# Altium project MSXII_ChargerInterface.PrjPcb (part 1 of 2)
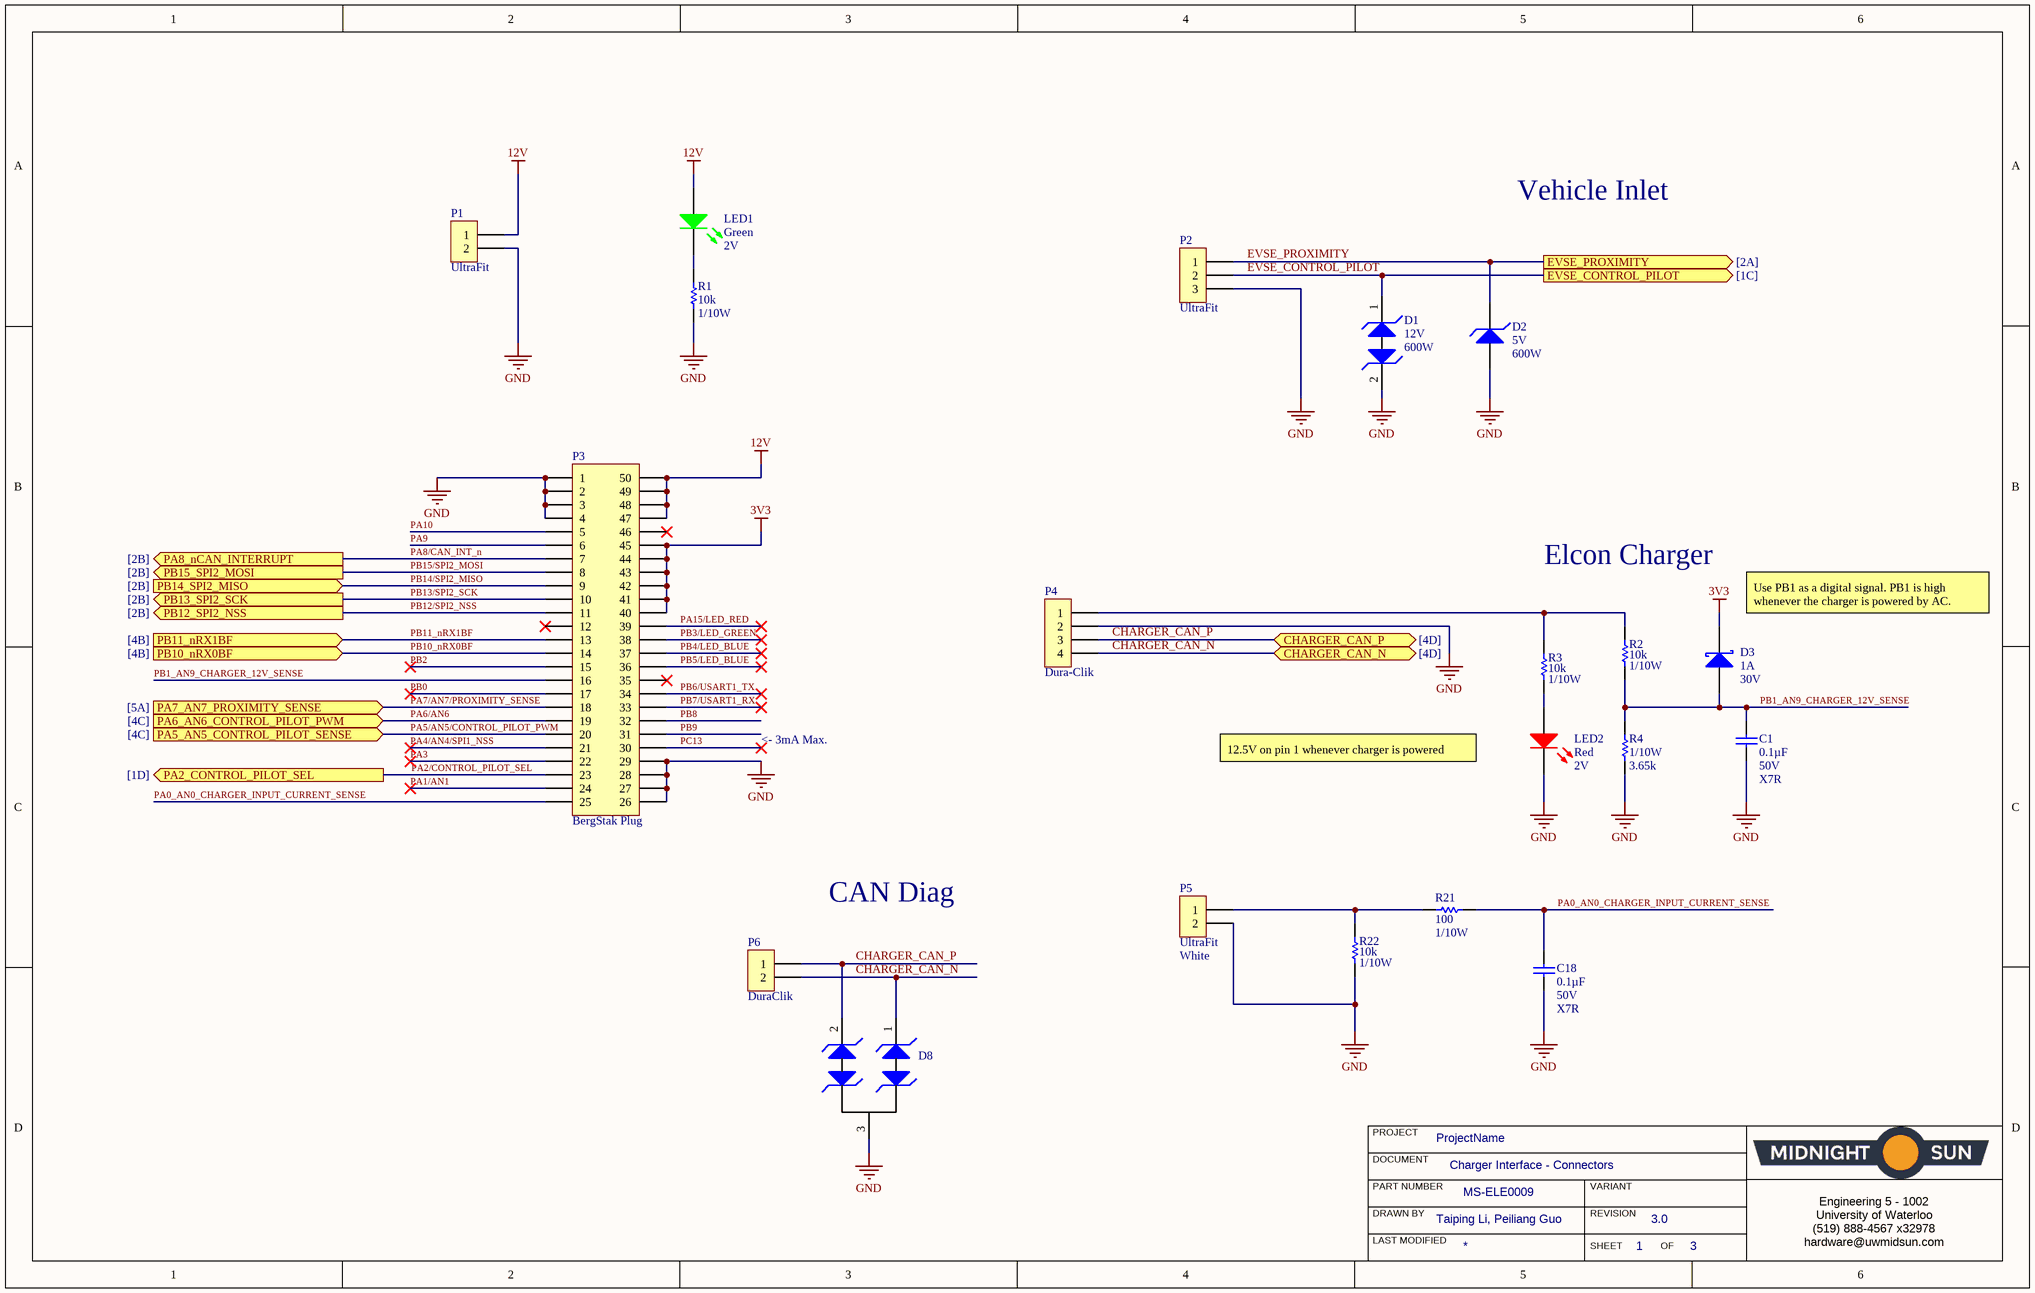
[diagram p0: Charger Interface - Connectors.SchDoc]
SheetTotal: 4; ProjectRevision: 3.0; ProjectAuthor: Taiping Li, Peiliang Guo; Project: Charger Interface Board; MSPartNumber: MS-ELE0009
3 sheets, 67 parts. Net scope: flat (ports and power ports of the same name join across sheets).
Board file: Charger Interface.PcbDoc
Sheets:
  Charger Interface - Connectors.SchDoc
  Charger Interface - CAN.SchDoc
  Charger Interface - J1772 Interface.SchDoc

## Sheet Charger Interface - Connectors.SchDoc: Charger Interface - Connectors
size B; Organization: Midnight Sun Solar Rayce Car Team; Address1: University of Waterloo; Address2: 200 University Ave W; Address3: Waterloo, ON, Canada; Address4: N2L 3E9; DocumentNumber: 1; SheetNumber: 1; SheetTotal: 3; Website: www.uwmidsun.com; ProjectName: ProjectName

### Parts
C1  Capacitance: 0.1µF  Voltage: 50V  Temperature Coefficient: X7R  [CAP, 0603]  (hidden comment: CAP CER 0.1UF 50V 10% X7R 0603)
C18  Capacitance: 0.1µF  Voltage: 50V  Temperature Coefficient: X7R  [CAP, 0603]  (hidden comment: CAP CER 0.1UF 50V 10% X7R 0603)
D1  Voltage - Reverse Standoff (Typ): 12V  Power - Peak Pulse: 600W  [DO-214AA Diode]  (hidden comment: DIODE TVS 12VWM 19.6VC DO-214AA (SMB))
D2  Voltage - Reverse Standoff (Typ): 5V  Power - Peak Pulse: 600W  [DO-214AA Diode]  (hidden comment: DIODE TVS 5VWM 9.1VC DO-214AA (SMB))
D3  Current - Average Rectified (Io): 1A  Voltage - DC Reverse (Vr) (Max): 30V  [DIODE SCHOTTKY 30V 1A POWERDI123]  (hidden comment: DIODE SCHOTTKY 30V 1A POWERDI123)
D8  DIODE TVS 24VWM 70VC SOT23  [MOSFET P-CH 30V 3.8A SOT-23]  (value not drawn)
LED1  Color: Green  Voltage - Forward (Vf) (Typ): 2V  [LED_0603]  (hidden comment: LED GREEN CLEAR 2V 0603)
LED2  Color: Red  Voltage - Forward (Vf) (Typ): 2V  [LED_0603]  (hidden comment: LED RED CLEAR 2V 0603)
P1  Series: UltraFit  [CONN, 2POS ULTRA-FIT]  (hidden comment: CONN 2POS ULTRA-FIT 0.138")
P2  Series: UltraFit  [CONN, 3POS ULTRA-FIT]  (hidden comment: CONN 3POS ULTRA-FIT 0.138")
P3  Series: BergStak Plug  [CONN, Bergstak 50 Pos Plug]  (hidden comment: CONN 50POS Bergstak Plug 0.02")
P4  Dura-Clik  [CONN, 4POS DURA-CLIK VERT]
P5  Series: UltraFit  Color: White  [CONN, 2POS ULTRA-FIT - NATURAL COLOR]  (hidden comment: CONN 2POS ULTRA-FIT NATURAL COLOR 0.138")
P6  Series: DuraClik  [CONN, 2POS Dura-Click]  (hidden comment: CONN 2POS DURA-CLIK 0.079")
R1  Resistance: 10k  Power: 1/10W  [RES, 0603]  (hidden comment: RES 10K OHM 1% 1/10W 0603)
R2  Resistance: 10k  Power: 1/10W  [RES, 0603]  (hidden comment: RES 10K OHM 1% 1/10W 0603)
R3  Resistance: 10k  Power: 1/10W  [RES, 0603]  (hidden comment: RES 10K OHM 1% 1/10W 0603)
R4  Power Rating: 1/10W  Resistance: 3.65k  [RES, 0603]  (hidden comment: RES 3.65K OHM 0.1% 1/10W 0603)
R21  Resistance: 100  Power: 1/10W  [RES, 0603]  (hidden comment: RES 100 OHM 1% 1/10W 0603)
R22  Resistance: 10k  Power: 1/10W  [RES, 0603]  (hidden comment: RES 10K OHM 1% 1/10W 0603)

### Ports
CHARGER_CAN_N (bidir, see [4D]), CHARGER_CAN_P (bidir, see [4D]), EVSE_CONTROL_PILOT (out, see [1C]), EVSE_PROXIMITY (out, see [2A]), PA2_CONTROL_PILOT_SEL (out, see [1D]), PA5_AN5_CONTROL_PILOT_SENSE (in, see [4C]), PA6_AN6_CONTROL_PILOT_PWM (in, see [4C]), PA7_AN7_PROXIMITY_SENSE (in, see [5A]), PA8_nCAN_INTERRUPT (out, see [2B]), PB10_nRX0BF (in, see [4B]), PB11_nRX1BF (in, see [4B]), PB12_SPI2_NSS (out, see [2B]), PB13_SPI2_SCK (out, see [2B]), PB14_SPI2_MISO (in, see [2B]), PB15_SPI2_MOSI (out, see [2B])

### Nets
3V3: D3.2(K) P3.40 P3.41 P3.42 P3.43 P3.44 P3.45
12V: LED1.1(A) P1.1 P3.47 P3.48 P3.49 P3.50
GND: C1.2 C18.2 D1.2(Cathode2) D2.1 D8.3(Common_Cathode) LED2.2(K) P1.2 P2.3 P3.1 P3.2 P3.3 P3.4 P3.26 P3.27 P3.28 P3.29 P4.2 P5.2 R1.2 R4.2 R22.2
CHARGER_CAN_N: D8.1(Cathode1) P4.4 P6.2 ; port CHARGER_CAN_N
CHARGER_CAN_P: D8.2(Cathode2) P4.3 P6.1 ; port CHARGER_CAN_P
EVSE_CONTROL_PILOT: D1.1(Cathode1) P2.2 ; port EVSE_CONTROL_PILOT
EVSE_PROXIMITY: D2.2 P2.1 ; port EVSE_PROXIMITY
PA0_AN0_CHARGER_INPUT_CURRENT_SENSE: C18.1 P3.25 R21.2
PA1/AN1: P3.24
PA2/CONTROL_PILOT_SEL: P3.23 ; port PA2_CONTROL_PILOT_SEL
PA3: P3.22
PA4/AN4/SPI1_NSS: P3.21
PA5/AN5/CONTROL_PILOT_PWM: P3.20 ; port PA5_AN5_CONTROL_PILOT_SENSE
PA6/AN6: P3.19 ; port PA6_AN6_CONTROL_PILOT_PWM
PA7/AN7/PROXIMITY_SENSE: P3.18 ; port PA7_AN7_PROXIMITY_SENSE
PA8/CAN_INT_n: P3.7 ; port PA8_nCAN_INTERRUPT
PA9: P3.6
PA10: P3.5
PA15/LED_RED: P3.39
PB0: P3.17
PB1_AN9_CHARGER_12V_SENSE: C1.1 D3.1(A) P3.16 R2.2 R4.1
PB2: P3.15
PB3/LED_GREEN: P3.38
PB4/LED_BLUE: P3.37
PB5/LED_BLUE: P3.36
PB6/USART1_TX: P3.34
PB7/USART1_RX: P3.33
PB8: P3.32
PB9: P3.31
PB10_nRX0BF: P3.14 ; port PB10_nRX0BF
PB11_nRX1BF: P3.13 ; port PB11_nRX1BF
PB12/SPI2_NSS: P3.11 ; port PB12_SPI2_NSS
PB13/SPI2_SCK: P3.10 ; port PB13_SPI2_SCK
PB14/SPI2_MISO: P3.9 ; port PB14_SPI2_MISO
PB15/SPI2_MOSI: P3.8 ; port PB15_SPI2_MOSI
PC13: P3.30
NetLED1_2: LED1.2(K) R1.1
NetLED2_1: LED2.1(A) R3.2
NetP4_1: P4.1 R2.1 R3.1
NetP5_1: P5.1 R21.1 R22.1

Not connected (* = marked no-connect by the designer): P3 12* 35* 46*

### Notes on the sheet
- Vehicle Inlet
- Elcon Charger
- (near D3) Use PB1 as a digital signal. PB1 is high whenever the charger is powered by AC.
- <- 3mA Max.
- 12.5V on pin 1 whenever charger is powered
- CAN Diag
- PROJECT
- DOCUMENT
- DRAWN BY
- LAST MODIFIED
- PART NUMBER
- REVISION
- SHEET
- VARIANT
- OF
- Engineering 5 - 1002
  University of Waterloo
  (519) 888-4567 x32978
  hardware@uwmidsun.com

### Library data of the parts
C1 C18 = CAP CER 0.1UF 50V 10% X7R 0603: 0.10µF ±10% 50V Ceramic Capacitor X7R 0603 (1608 Metric); Manufacturer 1: AVX Corporation; Manufacturer Part Number 1: 06035C104KAT2A; Supplier 1: Digi-Key; Supplier Part Number 1: 478-5052-1-ND; Packaging: Cut Tape (CT); Part Status: Active; Operating Temperature: -55°C ~ 125°C; Ratings: -; Mounting Type: Surface Mount, MLCC; Package / Case: 0603 (1608 Metric); Size / Dimension: 0.063" L x 0.032" W (1.60mm x 0.81mm); Height - Seated (Max): -; Thickness (Max): 0.035" (0.90mm); Lead Spacing: -; Lead Style: -; ComponentLink1URL: http://datasheets.avx.com/X7RDielectric.pdf; ComponentLink1Description: http://datasheets.avx.com/X7RDielectric.pdf; Tolerance: ±10%
D1 = DIODE TVS 12VWM 19.6VC DO-214AA (SMB): TVS DIODE 12V 19.6V DO214AA; Manufacturer: Vishay Semiconductor Diodes Division; Manufacturer Part Number: SMBJ12CD-M3/H; Type: Zener; Voltage - Breakdown (Min): 13.5V; Current - Peak Pulse (10/1000µs): 30.6A; Power Line Protection: No; Supplier 1: Digi-Key; RoHS: RoHS Compliant; Category: Circuit Protection; Stock 1: 4469; Pricing 1: 1=0.69, 10=0.565, 25=0.516, 100=0.3841, 250=0.34808 (CAD); Packaging: Cut Tape (CT); Part Status: Active; Voltage - Clamping (Max) @ Ipp: 19.6V; Applications: General Purpose; Capacitance @ Frequency: -; Operating Temperature: -55°C ~ 150°C (TJ); Mounting Type: Surface Mount; Package / Case: DO-214AA, SMB; Supplier Device Package: DO-214AA (SMBJ); ComponentLink1URL: http://www.vishay.com/docs/87606/87606.pdf; ComponentLink1Description: http://www.vishay.com/docs/87606/87606.pdf; Supplier Part Number 1: SMBJ12CD-M3/HGICT-ND
D2 = DIODE TVS 5VWM 9.1VC DO-214AA (SMB): TVS DIODE 5V 9.1V DO214AA; Manufacturer: Vishay Semiconductor Diodes Division; Manufacturer Part Number: SMBJ5.0D-M3/H; Type: Zener; Voltage - Breakdown (Min): 6.5V; Current - Peak Pulse (10/1000µs): 65.9A; Power Line Protection: No; Supplier 1: Digi-Key; RoHS: RoHS Compliant; Category: Circuit Protection; Stock 1: 6900; Pricing 1: 1=0.51, 10=0.416, 25=0.3808, 100=0.2833, 250=0.25668 (CAD); Packaging: Cut Tape (CT); Part Status: Active; Voltage - Clamping (Max) @ Ipp: 9.1V; Applications: General Purpose; Capacitance @ Frequency: -; Operating Temperature: -55°C ~ 150°C (TJ); Mounting Type: Surface Mount; Package / Case: DO-214AA, SMB; Supplier Device Package: DO-214AA (SMBJ); ComponentLink1URL: http://www.vishay.com/docs/87606/87606.pdf; ComponentLink1Description: http://www.vishay.com/docs/87606/87606.pdf; Supplier Part Number 1: SMBJ5.0D-M3/HGICT-ND
D3 = DIODE SCHOTTKY 30V 1A POWERDI123: Diode Schottky 30V 1A Surface Mount PowerDI™ 123; Manufacturer: Diodes Incorporated; Manufacturer Part Number: DFLS130L-7; Speed: Fast Recovery =< 500ns, > 200mA (Io); Current - Reverse Leakage @ Vr: 1mA @ 30V; Capacitance @ Vr, F: 76pF @ 10V, 1MHz; Voltage - Forward (Vf) (Max) @ If: 310mV @ 1A; Supplier 1: Digi-Key; RoHS: RoHS Compliant; Category: Discrete Semiconductor Products; Stock 1: 68200; Packaging: Cut Tape (CT); Part Status: Active; Diode Type: Schottky; Mounting Type: Surface Mount; Package / Case: POWERDI®123; Supplier Device Package: PowerDI™ 123; Operating Temperature - Junction: -40°C ~ 125°C; ComponentLink1URL: https://www.diodes.com/assets/Datasheets/ds30492.pdf; ComponentLink1Description: https://www.diodes.com/assets/Datasheets/ds30492.pdf; Supplier Part Number 1: DFLS130LDICT-ND; Pricing 1: 1=0.7, 10=0.599, 100=0.447, 500=0.35126, 1000=0.27142 (CAD)
D8 = DIODE TVS 24VWM 70VC SOT23: TVS DIODE 24VWM 70VC SOT23; Manufacturer 1: Nexperia USA Inc.; Manufacturer Part Number 1: PESD1CAN,215; Type: Zener; Voltage - Breakdown (Min): 25.4V; Voltage - Clamping (Max) @ Ipp: 70V; Current - Peak Pulse (10/1000µs): 3A (8/20µs); Power - Peak Pulse: 200W; Power Line Protection: No; Capacitance @ Frequency: 11pF @ 1MHz; Supplier 1: Digi-Key; Supplier Part Number 1: 1727-3817-1-ND; Packaging: Cut Tape (CT); Part Status: Active; Operating Temperature: -65°C ~ 150°C (TA); Mounting Type: Surface Mount; Package / Case: TO-236-3, SC-59, SOT-23-3; Supplier Device Package: SOT-23 (TO-236AB); ComponentLink1URL: http://assets.nexperia.com/documents/data-sheet/PESD1CAN.pdf; ComponentLink1Description: http://assets.nexperia.com/documents/data-sheet/PESD1CAN.pdf
LED1 = LED GREEN CLEAR 2V 0603: Green 572nm LED Indication - Discrete 2V 0603 (1608 Metric); Manufacturer: Wurth Electronics Inc.; Manufacturer Part Number: 150060VS75000; Lens Color: Colorless; Millicandela Rating: 40mcd; Lens Style/Size: Rectangle with Flat Top, 1.10mm x 0.70mm; Current - Test: 20mA; Viewing Angle: 140°; Wavelength - Dominant: 570nm; Supplier 1: Digi-Key; RoHS: RoHS Compliant; Category: Optoelectronics; Stock 1: 9408; Pricing 1: 1=0.21, 100=0.1617, 500=0.13964 (CAD); Packaging: Cut Tape (CT); Part Status: Active; Lens Transparency: Clear; Mounting Type: Surface Mount; Wavelength - Peak: 572nm; Features: -; Package / Case: 0603 (1608 Metric); Supplier Device Package: 0603; Size / Dimension: 1.60mm L x 0.80mm W; Height (Max): 0.80mm; ComponentLink1URL: http://katalog.we-online.de/led/datasheet/150060VS75000.pdf; ComponentLink1Description: http://katalog.we-online.de/led/datasheet/150060VS75000.pdf; Supplier Part Number 1: 732-4980-1-ND
LED2 = LED RED CLEAR 2V 0603: Red 631nm LED Indication - Discrete 2V 0603 (1608 Metric); Manufacturer: Wurth Electronics Inc.; Manufacturer Part Number: 150060RS75000; Lens Color: Colorless; Millicandela Rating: 250mcd; Lens Style/Size: Rectangle with Flat Top, 1.10mm x 0.70mm; Current - Test: 20mA; Viewing Angle: 140°; Wavelength - Dominant: 625nm; Wavelength - Peak: 630nm; Supplier 1: Digi-Key; RoHS: RoHS Compliant; Category: Optoelectronics; Stock 1: 35521; Pricing 1: 1=0.21, 100=0.1617, 500=0.13964 (CAD); Packaging: Cut Tape (CT); Part Status: Active; Lens Transparency: Clear; Mounting Type: Surface Mount; Features: -; Package / Case: 0603 (1608 Metric); Supplier Device Package: 0603; Size / Dimension: 1.60mm L x 0.80mm W; Height (Max): 0.80mm; ComponentLink1URL: http://katalog.we-online.de/led/datasheet/150060RS75000.pdf; ComponentLink1Description: http://katalog.we-online.de/led/datasheet/150060RS75000.pdf; Supplier Part Number 1: 732-4978-1-ND
P1 = CONN 2POS ULTRA-FIT 0.138": 2 Positions Header, Shrouded Connector 0.138" (3.50mm) Through Hole Gold; Manufacturer 1: Molex, LLC; Manufacturer Part Number 1: 1722861302; Style: Board to Board or Cable; Shrouding: Shrouded - 4 Wall; Number of Positions: 2; Number of Positions Loaded: All; Contact Length - Post: 0.126" (3.20mm); Material Flammability Rating: UL94 V-0; Mated Stacking Heights: 26.99mm; Voltage: 400V; Supplier 1: Digi-Key; Supplier Part Number 1: WM11673-ND; Packaging: Tray; Part Status: Active; Connector Type: Header; Contact Type: Male Pin; Pitch - Mating: 0.138" (3.50mm); Number of Rows: 1; Row Spacing - Mating: -; Mounting Type: Through Hole; Termination: Kinked Pin, Solder; Fastening Type: Latch Holder; Contact Length - Mating: -; Overall Contact Length: -; Insulation Height: 0.465" (11.80mm); Contact Shape: Square; Contact Finish - Mating: Gold; Contact Finish Thickness - Mating: 30µin (0.76µm); Contact Finish - Post: Tin; Contact Material: Copper Alloy; Insulation Material: Liquid Crystal Polymer (LCP); Operating Temperature: -40°C ~ 120°C; Ingress Protection: -; Insulation Color: Black; Current Rating: -; Contact Finish Thickness - Post: 60µin (1.52µm); ComponentLink1URL: http://www.molex.com/pdm_docs/sd/1722861302_sd.pdf; ComponentLink1Description: http://www.molex.com/pdm_docs/sd/1722861302_sd.pdf
P2 = CONN 3POS ULTRA-FIT 0.138": 3 Positions Header Connector 0.138" (3.50mm) Through Hole Tin; Manufacturer 1: Molex, LLC; Manufacturer Part Number 1: 1722871103; Style: Board to Cable/Wire; Shrouding: Shrouded - 4 Wall; Number of Positions: 3; Number of Positions Loaded: All; Contact Length - Post: 0.126" (3.20mm); Material Flammability Rating: UL94 V-0; Mated Stacking Heights: 26.99mm; Voltage: 400V; Supplier 1: Digi-Key; Supplier Part Number 1: WM11702-ND; Packaging: Tray; Part Status: Active; Connector Type: Header; Contact Type: Male Pin; Pitch - Mating: 0.138" (3.50mm); Number of Rows: 1; Row Spacing - Mating: -; Mounting Type: Through Hole; Termination: Solder; Fastening Type: Latch Holder; Contact Length - Mating: -; Overall Contact Length: -; Insulation Height: 0.465" (11.80mm); Contact Shape: Square; Contact Finish - Mating: Tin; Contact Finish Thickness - Mating: 60µin (1.52µm); Contact Finish - Post: Tin; Contact Material: Copper Alloy; Insulation Material: Liquid Crystal Polymer (LCP); Operating Temperature: -40°C ~ 105°C; Ingress Protection: -; Insulation Color: Black; Current Rating: -; Contact Finish Thickness - Post: 60µin (1.52µm); ComponentLink1URL: http://www.molex.com/pdm_docs/sd/1722871103_sd.pdf; ComponentLink1Description: http://www.molex.com/pdm_docs/sd/1722871103_sd.pdf
P3 = CONN 50POS Bergstak Plug 0.02": 50 Position Connector Plug, Outer Shroud Contacts Surface Mount Gold; Manufacturer 1: Amphenol FCI; Manufacturer Part Number 1: 10132797-055100LF; Number of Positions: 50; Mated Stacking Heights: 5mm; Pitch: 0.020" (0.50mm); Supplier 1: Digi-Key; Supplier Part Number 1: 609-5226-1-ND; Packaging: Cut Tape (CT); Part Status: Active; Connector Type: Plug, Outer Shroud Contacts; Number of Rows: 2; Mounting Type: Surface Mount; Contact Finish: Gold; Contact Finish Thickness: 1µin (0.025µm); Height Above Board: 0.169" (4.30mm); ComponentLink1URL: http://portal.fciconnect.com/Comergent//fci/drawing/10132797.pdf; ComponentLink1Description: http://portal.fciconnect.com/Comergent//fci/drawing/10132797.pdf
P4 = CONN 4POS DURA-CLIK 0.079": 4 Positions Header Connector 0.079" (2.00mm) Surface Mount Tin; Manufacturer: Molex, LLC; Manufacturer Part Number: 5600200420; Style: Board to Cable/Wire; Shrouding: Shrouded - 4 Wall; Number of Positions: 4; Number of Positions Loaded: All; Mated Stacking Heights: 9.3mm; Supplier 1: Digi-Key; RoHS: RoHS Compliant; Category: Connectors, Interconnects; Stock 1: 9367; Pricing 1: 1=2.23, 10=2.022, 25=1.898, 50=1.8156, 100=1.733 (CAD); Packaging: Cut Tape (CT); Part Status: Active; Connector Type: Header; Contact Type: Male Pin; Pitch - Mating: 0.079" (2.00mm); Number of Rows: 1; Row Spacing - Mating: -; Mounting Type: Surface Mount; Termination: Solder; Fastening Type: Latch Lock; Contact Length - Mating: -; Contact Length - Post: -; Overall Contact Length: -; Insulation Height: 0.315" (8.00mm); Contact Shape: Square; Contact Finish - Mating: Tin; Contact Finish Thickness - Mating: -; Contact Finish - Post: Tin; Contact Material: Copper Alloy; Insulation Material: Polyamide (PA), Nylon; Features: Solder Retention; Operating Temperature: -; Ingress Protection: -; Material Flammability Rating: -; Insulation Color: Natural; Current Rating: -; Voltage Rating: -; Contact Finish Thickness - Post: -; Applications: Automotive, Industrial; ComponentLink1URL: http://www.molex.com/pdm_docs/sd/5600200420_sd.pdf; ComponentLink1Description: http://www.molex.com/pdm_docs/sd/5600200420_sd.pdf; Supplier Part Number 1: WM10864CT-ND
P5 = CONN 2POS ULTRA-FIT NATURAL COLOR 0.138": 2 Positions Header, Shrouded Connector 0.138" (3.50mm) Through Hole; Manufacturer 1: Molex, LLC; Manufacturer Part Number 1: 1722872102; Style: Board to Cable/Wire; Shrouding: Shrouded - 4 Wall; Number of Positions: 2; Number of Positions Loaded: All; Contact Length - Post: 0.126" (3.20mm); Material Flammability Rating: UL94 V-0; Mated Stacking Heights: 26.99mm; Voltage: 400V; Supplier 1: Digi-Key; Supplier Part Number 1: WM11722-ND; Packaging: Tray; Part Status: Active; Connector Type: Header; Contact Type: Male Pin; Pitch - Mating: 0.138" (3.50mm); Number of Rows: 1; Row Spacing - Mating: -; Mounting Type: Through Hole; Termination: Solder; Fastening Type: Latch Holder; Contact Length - Mating: -; Overall Contact Length: -; Insulation Height: 0.465" (11.80mm); Contact Shape: Square; Contact Finish - Mating: Tin; Contact Finish Thickness - Mating: 60µin (1.52µm); Contact Finish - Post: Tin; Contact Material: Copper Alloy; Insulation Material: Liquid Crystal Polymer (LCP); Operating Temperature: -40°C ~ 105°C; Ingress Protection: -; Insulation Color: Natural; Current Rating: -; Contact Finish Thickness - Post: 60µin (1.52µm); ComponentLink1URL: http://www.molex.com/pdm_docs/sd/1722872102_sd.pdf; ComponentLink1Description: http://www.molex.com/pdm_docs/sd/1722872102_sd.pdf
P6 = CONN 2POS DURA-CLIK 0.079": 2 Positions Header, Shrouded Connector 0.079" (2.00mm) Surface Mount, Right Angle Tin; Manufacturer 1: Molex, LLC; Manufacturer Part Number 1: 5023520200; Style: Board to Cable/Wire; Shrouding: Shrouded - 4 Wall; Number of Positions: 2; Number of Positions Loaded: All; Contact Length - Mating: 0.135" (3.45mm); Material Flammability Rating: UL94 V-0; Mated Stacking Heights: 11mm; Supplier 1: Digi-Key; Supplier Part Number 1: WM7169CT-ND; Packaging: Cut Tape (CT); Part Status: Active; Connector Type: Header; Contact Type: Male Pin; Number of Rows: 1; Row Spacing - Mating: -; Mounting Type: Surface Mount, Right Angle; Termination: Solder; Fastening Type: Latch Lock; Contact Length - Post: -; Overall Contact Length: -; Insulation Height: 0.252" (6.40mm); Contact Shape: Square; Contact Finish - Mating: Tin; Contact Finish Thickness - Mating: -; Contact Finish - Post: Tin; Contact Material: Copper Alloy; Insulation Material: Polyamide (PA), Nylon; Operating Temperature: -; Ingress Protection: -; Insulation Color: Natural; Current Rating: -; Contact Finish Thickness - Post: -; ComponentLink1URL: http://www.molex.com/pdm_docs/sd/5023520200_sd.pdf; ComponentLink1Description: http://www.molex.com/pdm_docs/sd/5023520200_sd.pdf; Voltage: -; Pitch - Mating: 0.079" (2.00mm)
R1-R3 R22 = RES 10K OHM 1% 1/10W 0603: RES SMD 10K OHM 1% 1/10W 0603; Manufacturer 1: Yageo; Manufacturer Part Number 1: RC0603FR-0710KL; Temperature Coefficient: ±100ppm/°C; Supplier 1: Digi-Key; Supplier Part Number 1: 311-10.0KHRCT-ND; Packaging: Cut Tape (CT); Part Status: Active; Composition: Thick Film; Operating Temperature: -55°C ~ 155°C; Package / Case: 0603 (1608 Metric); Supplier Device Package: 0603; Size / Dimension: 0.063" L x 0.031" W (1.60mm x 0.80mm); Height - Seated (Max): 0.022" (0.55mm); Failure Rate: -; ComponentLink1URL: http://www.yageo.com/documents/recent/PYu-RC_Group_51_RoHS_L_7.pdf; ComponentLink1Description: http://www.yageo.com/documents/recent/PYu-RC_Group_51_RoHS_L_7.pdf; Tolerance: ±1%
R4 = RES 3.65K OHM 0.1% 1/10W 0603: 3.65 kOhms ±0.1% 0.1W, 1/10W Chip Resistor 0603 (1608 Metric) Automotive AEC-Q200 Thin Film; Manufacturer: Panasonic; Manufacturer Part Number: ERA3AEB3651V; Voltage Rating: 150V; Temperature Coefficient: 25ppm/°C; Max Power Dissipation: 100mW; Voltage Rating (DC): 75V; Supplier 1: Digi-Key; Stock 1: 140813; Pricing 1: 1=0.35, 10=0.3, 100=0.1172, 1000=0.0491, 2500=0.045 (USD); Mount: Surface Mount; Case/Package: 0603; Number of Pins: 2; Weight: 7.1E-05oz; Case Code (Metric): 1608; Case Code (Imperial): 0603; Contact Plating: Tin; Min Operating Temperature: -55°C; Max Operating Temperature: 155°C; Tolerance: 0.1%; Packaging: Tape and Reel; Package Quantity: 1; Composition: Metal Film,Thin Film; Number of Terminations: 2; Termination: SMD/SMT; Military Standard: Not; Length: 1.6mm; Height: 0.45mm; Width: 0.8mm; Depth: 0.8mm; Radiation Hardening: No; Lead Free: Lead Free; ComponentLink1URL: https://datasheet.ciiva.com/11810/0900766b80eb1d8c-11810288.pdf; ComponentLink1Description: https://datasheet.ciiva.com/11810/0900766b80eb1d8c-11810288.pdf; ComponentLink2URL: https://datasheet.ciiva.com/5974/485442-5974022.pdf; ComponentLink2Description: https://datasheet.ciiva.com/5974/485442-5974022.pdf; ComponentLink3URL: https://datasheet.ciiva.com/9196/aoa0000ce26-9196230.pdf; ComponentLink3Description: https://datasheet.ciiva.com/9196/aoa0000ce26-9196230.pdf; ComponentLink4URL: https://datasheet.ciiva.com/7911/485442-7911543.pdf; ComponentLink4Description: https://datasheet.ciiva.com/7911/485442-7911543.pdf; ComponentLink5URL: https://datasheet.ciiva.com/17213/aoa0000ce26-17213543.pdf; ComponentLink5Description: https://datasheet.ciiva.com/17213/aoa0000ce26-17213543.pdf; ComponentLink6URL: https://datasheet.ciiva.com/41450/001180837-da-01-en-widerstand-era-0603-3k65-0-1-5000st-41450154.pdf; ComponentLink6Description: https://datasheet.ciiva.com/41450/001180837-da-01-en-widerstand-era-0603-3k65-0-1-5000st-41450154.pdf; Supplier Part Number 1: P3.65KDBCT-ND
R21 = RES 100 OHM 1% 1/10W 0603: 100 Ohm ±1% 0.1W, 1/10W Chip Resistor 0603 (1608 Metric) Moisture Resistant Thick Film; Manufacturer 1: Yageo; Manufacturer Part Number 1: RC0603FR-07100RL; Temperature Coefficient: ±100ppm/°C; Supplier 1: Digi-Key; Supplier Part Number 1: 311-100HRCT-ND; Packaging: Cut Tape (CT); Part Status: Active; Composition: Thick Film; Operating Temperature: -55°C ~ 155°C; Package / Case: 0603 (1608 Metric); Supplier Device Package: 0603; Size / Dimension: 0.063" L x 0.031" W (1.60mm x 0.80mm); Height - Seated (Max): 0.022" (0.55mm); Failure Rate: -; ComponentLink1URL: http://www.yageo.com/documents/recent/PYu-RC_Group_51_RoHS_L_7.pdf; ComponentLink1Description: http://www.yageo.com/documents/recent/PYu-RC_Group_51_RoHS_L_7.pdf; Tolerance: ±1%

## Sheet Charger Interface - CAN.SchDoc: Charger Interface - CAN
size B; PageSetup: Record=PageOptions|CenterHorizontal=True|CenterVertical=True|PrintScale=0.64|XCorrection=1.00|YCorrection=1.00|PrintKind=1|BorderSize=5000000|LeftOffset=0|BottomOffset=0|Orientation=2|PaperLength=1000|PaperWidth=1000|Scale=100|PaperSource=7|PrintQuality=-3|MediaType=1|DitherType=10|PrintScaleMode=1|PaperKind=Letter|PaperIndex=1; Organization: Midnight Sun Solar Rayce Car Team; Address1: University of Waterloo; Address2: 200 University Ave W; Address3: Waterloo, ON, Canada; Address4: N2L 3E9; DocumentNumber: 2; SheetNumber: 2; SheetTotal: 3; Website: www.uwmidsun.com; ProjectName: ProjectName
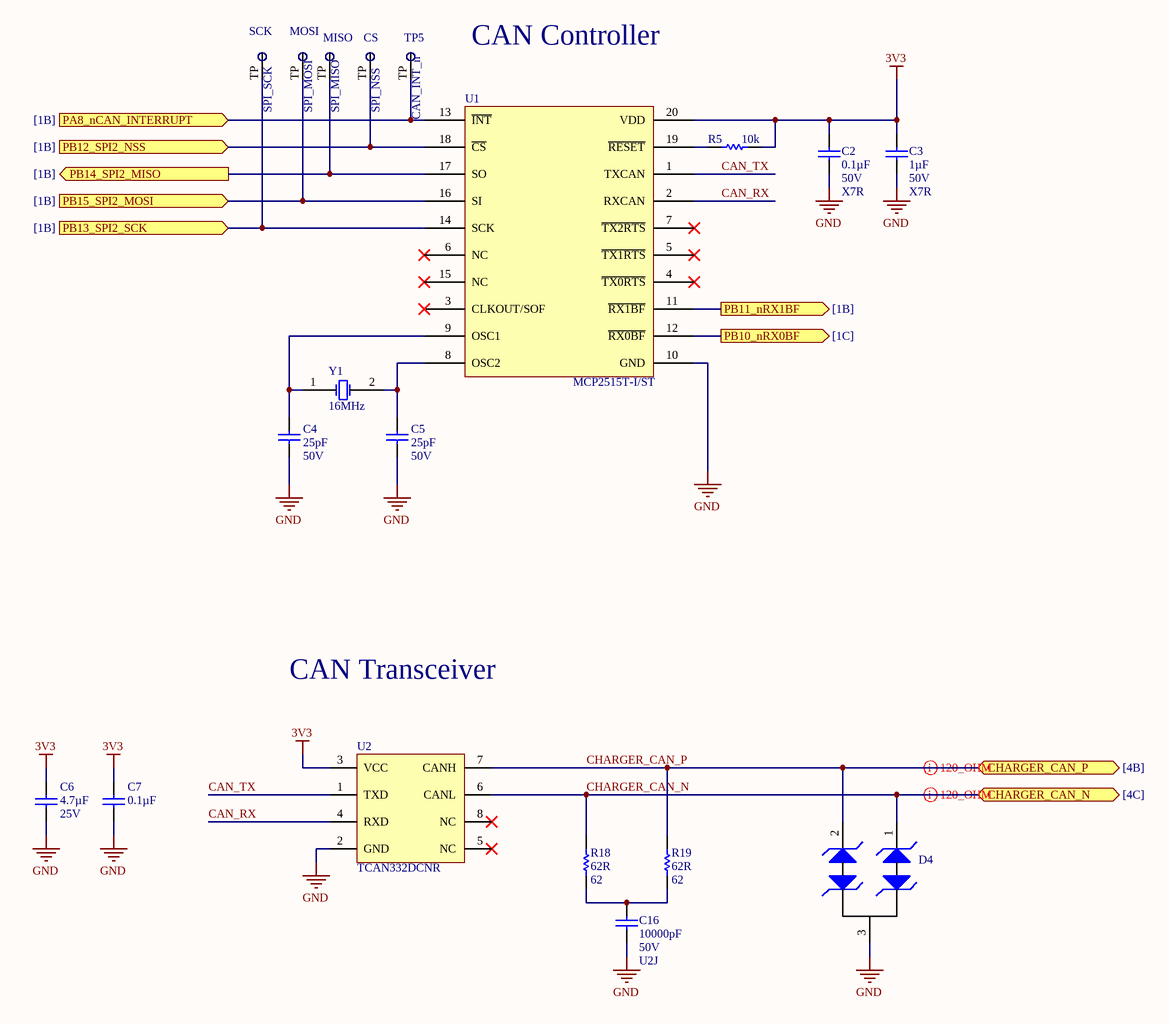
[diagram p1: Charger Interface - CAN.SchDoc]

### Parts
C2  Capacitance: 0.1µF  Voltage: 50V  Temperature Coefficient: X7R  [CAP, 0603]  (hidden comment: CAP CER 0.1UF 50V 10% X7R 0603)
C3  Capacitance: 1µF  Voltage: 50V  Temperature Coefficient: X7R  [CAP, 0603]  (hidden comment: CAP CER 1UF 50V 10% X7R 0603)
C4  Voltage - Rated: 50V  Capacitance: 25pF  [CAP, 0603]  (hidden comment: CAP CER 25PF 50V ±5% C0G/NP0 0603)
C5  Voltage - Rated: 50V  Capacitance: 25pF  [CAP, 0603]  (hidden comment: CAP CER 25PF 50V ±5% C0G/NP0 0603)
C6  Voltage: 25V  Capacitance: 4.7µF  [CAP, 0603]  (hidden comment: CAP CER 4.7UF 25V 10% X5R 0603)
C7  Capacitance: 0.1µF  [CAP, 0603]  (hidden comment: CAP CER 0.1UF 50V 10% X7R 0603)
C16  Capacitance: 10000pF  Voltage: 50V  Temperature Coefficient: U2J  [CAP, 0603]  (hidden comment: CAP CER 10nF 50V 5% X7R 0603)
CS  SPI_NSS  [Test Point]  (no BOM)
D4  DIODE TVS 24VWM 70VC SOT23  [MOSFET P-CH 30V 3.8A SOT-23]  (value not drawn)
MISO  SPI_MISO  [Test Point]  (no BOM)
MOSI  SPI_MOSI  [Test Point]  (no BOM)
R5  Resistance: 10k  [RES, 0603]  (hidden comment: RES 10K OHM 1% 1/10W 0603)
R18  62R  value 62  [RES, 0603]
R19  62R  value 62  [RES, 0603]
SCK  SPI_SCK  [Test Point]  (no BOM)
TP5  CAN_INT_n  [Test Point]  (no BOM)
U1  Manufacturer Part Number: MCP2515T-I/ST  [TSSOP65P640X120-20N]  (hidden comment: MCP2515)
U2  Manufacturer Part Number: TCAN332DCNR  [TSOP65P280X145-8N]  (hidden comment: IC CAN Tranceiver TCAN332DR)
Y1  Frequency: 16MHz  [ABM3 CRYSTAL]  (hidden comment: CRYSTAL 16 MHz 18PF 2-SMD)

### Ports
CHARGER_CAN_N (bidir, see [4C]), CHARGER_CAN_P (bidir, see [4B]), PA8_nCAN_INTERRUPT (in, see [1B]), PB10_nRX0BF (out, see [1C]), PB11_nRX1BF (out, see [1B]), PB12_SPI2_NSS (in, see [1B]), PB13_SPI2_SCK (in, see [1B]), PB14_SPI2_MISO (out, see [1B]), PB15_SPI2_MOSI (in, see [1B])

### Nets
3V3: C2.1 C3.1 C6.2 C7.2 R5.2 U1.20(VDD) U2.3(VCC)
GND: C2.2 C3.2 C4.2 C5.2 C6.1 C7.1 C16.2 D4.3(Common_Cathode) U1.10(GND) U2.2(GND)
CAN_RX: U1.2(RXCAN) U2.4(RXD)
CAN_TX: U1.1(TXCAN) U2.1(TXD)
CHARGER_CAN_N: D4.1(Cathode1) R18.1 U2.6(CANL) ; port CHARGER_CAN_N
CHARGER_CAN_P: D4.2(Cathode2) R19.1 U2.7(CANH) ; port CHARGER_CAN_P
PA8/CAN_INT_n: TP5.TP U1.13(~{INT}) ; port PA8_nCAN_INTERRUPT
PB10_nRX0BF: U1.12(~{RX0BF}) ; port PB10_nRX0BF
PB11_nRX1BF: U1.11(~{RX1BF}) ; port PB11_nRX1BF
PB12/SPI2_NSS: CS.TP U1.18(~{CS}) ; port PB12_SPI2_NSS
PB13/SPI2_SCK: SCK.TP U1.14(SCK) ; port PB13_SPI2_SCK
PB14/SPI2_MISO: MISO.TP U1.17(SO) ; port PB14_SPI2_MISO
PB15/SPI2_MOSI: MOSI.TP U1.16(SI) ; port PB15_SPI2_MOSI
NetC4_1: C4.1 U1.9(OSC1) Y1.1
NetC5_1: C5.1 U1.8(OSC2) Y1.2
NetC16_1: C16.1 R18.2 R19.2
NetR5_1: R5.1 U1.19(~{RE}~{SET})

Not connected (* = marked no-connect by the designer): U1 3(CLKOUT/SOF)* 4(~{TX0RTS})* 5(~{TX1RTS})* 6(NC)* 7(~{TX2RTS})* 15(NC)*; U2 5(NC)* 8(NC)*

### Layout directives
differential pair: CHARGER_CAN_N, CHARGER_CAN_P

### Notes on the sheet
- CAN Controller
- CAN Transceiver
- PROJECT
- DOCUMENT
- DRAWN BY
- LAST MODIFIED
- PART NUMBER
- REVISION
- SHEET
- VARIANT
- OF
- Engineering 5 - 1002
  University of Waterloo
  (519) 888-4567 x32978
  hardware@uwmidsun.com

### Library data of the parts
C2 C7 = CAP CER 0.1UF 50V 10% X7R 0603: as C1 on sheet Charger Interface - Connectors; Supplier 1: Digi-Key; Supplier Part Number 1: 478-5052-1-ND; Packaging: Cut Tape (CT); Part Status: Active; Operating Temperature: -55°C ~ 125°C; Ratings: -; Mounting Type: Surface Mount, MLCC; Package / Case: 0603 (1608 Metric); Size / Dimension: 0.063" L x 0.032" W (1.60mm x 0.81mm); Height - Seated (Max): -; Thickness (Max): 0.035" (0.90mm); Lead Spacing: -; Lead Style: -; ComponentLink1URL: http://datasheets.avx.com/X7RDielectric.pdf; ComponentLink1Description: http://datasheets.avx.com/X7RDielectric.pdf; Tolerance: ±10%
  C7: Voltage: 50V; Temperature Coefficient: X7R
C3 = CAP CER 1UF 50V 10% X7R 0603: 1µF ±10% 50V Ceramic Capacitor X7R 0603 (1608 Metric); Manufacturer 1: Taiyo Yuden; Manufacturer Part Number 1: UMK107AB7105KA-T; Supplier 1: Digi-Key; Supplier Part Number 1: 587-3247-1-ND; Packaging: Cut Tape (CT); Part Status: Active; Operating Temperature: -55°C ~ 125°C; Ratings: -; Mounting Type: Surface Mount, MLCC; Package / Case: 0603 (1608 Metric); Size / Dimension: 0.063" L x 0.031" W (1.60mm x 0.80mm); Height - Seated (Max): -; Thickness (Max): 0.037" (0.95mm); Lead Spacing: -; Lead Style: -; ComponentLink1URL: http://www.yuden.co.jp/productdata/catalog/en/mlcc_all_e.pdf; ComponentLink1Description: http://www.yuden.co.jp/productdata/catalog/en/mlcc_all_e.pdf; Tolerance: ±10%
C4 C5 = CAP CER 25PF 50V ±5% C0G/NP0 0603: 25pF 50V Ceramic Capacitor C0G, NP0 0603 (1608 Metric) 0.063" L x 0.032" W (1.60mm x 0.80mm); Manufacturer: Samsung Electro-Mechanics; Manufacturer Part Number: CL10C250JB8NNNC; Notification: Current market demand for these product types have resulted in fluctuating and extending lead times. Lead times may differ.; Supplier 1: Digi-Key; RoHS: RoHS Compliant; Category: Capacitors; Stock 1: 36668; Pricing 1: 1=0.14, 10=0.061, 100=0.0274, 500=0.01962, 1000=0.01542 (CAD); Packaging: Cut Tape (CT); Part Status: Active; Tolerance: ±5%; Operating Temperature: -55°C ~ 125°C; Features: -; Ratings: -; Applications: General Purpose; Mounting Type: Surface Mount, MLCC; Package / Case: 0603 (1608 Metric); Size / Dimension: 0.063" L x 0.032" W (1.60mm x 0.80mm); Height - Seated (Max): -; Thickness (Max): 0.035" (0.90mm); Lead Spacing: -; Lead Style: -; ComponentLink1URL: http://www.samsungsem.com/kr/support/product-search/mlcc/CL10C250JB8NNNC.jsp; ComponentLink1Description: http://www.samsungsem.com/kr/support/product-search/mlcc/CL10C250JB8NNNC.jsp; Supplier Part Number 1: 1276-2244-1-ND; Temperature Coefficient: C0G, NP0
C6 = CAP CER 4.7UF 25V 10% X5R 0603: 4.7µF ±10% 25V Ceramic Capacitor X5R 0603 (1608 Metric); Manufacturer 1: Murata Electronics North America; Manufacturer Part Number 1: GRM188R61E475KE11D; Supplier 1: Digi-Key; Supplier Part Number 1: 490-7203-1-ND; Packaging: Cut Tape (CT); Part Status: Active; Operating Temperature: -55°C ~ 85°C; Ratings: -; Mounting Type: Surface Mount, MLCC; Package / Case: 0603 (1608 Metric); Size / Dimension: 0.063" L x 0.031" W (1.60mm x 0.80mm); Height - Seated (Max): -; Thickness (Max): 0.031" (0.80mm); Lead Spacing: -; Lead Style: -; ComponentLink1URL: http://www.murata.com/~/media/webrenewal/support/library/catalog/products/capacitor/mlcc/c02e.ashx; ComponentLink1Description: http://www.murata.com/~/media/webrenewal/support/library/catalog/products/capacitor/mlcc/c02e.ashx; Tolerance: ±10%; Temperature Coefficient: X5R
C16 = CAP CER 10nF 50V 5% X7R 0603: 10000pF ±5% 50V Ceramic Capacitor U2J 0603 (1608 Metric); Manufacturer 1: KEMET; Manufacturer Part Number 1: C0603C103J5JAC7867; Supplier 1: Digi-Key; Supplier Part Number 1: 399-13384-1-ND; Packaging: Cut Tape (CT); Part Status: Active; Operating Temperature: -55°C ~ 125°C; Ratings: -; Failure Rate: -; Mounting Type: Surface Mount, MLCC; Package / Case: 0603 (1608 Metric); Size / Dimension: 0.063" L x 0.032" W (1.60mm x 0.80mm); Height - Seated (Max): -; Thickness (Max): 0.034" (0.87mm); Lead Spacing: -; Lead Style: -; ComponentLink1URL: http://www.kemet.com/docfinder?Partnumber=C0603C103J5JAC7867; ComponentLink1Description: http://www.kemet.com/docfinder?Partnumber=C0603C103J5JAC7867; Tolerance: ±5%
CS MISO MOSI SCK TP5 = Test Point
D4 = DIODE TVS 24VWM 70VC SOT23: as D8 on sheet Charger Interface - Connectors; Supplier 1: Digi-Key; Supplier Part Number 1: 1727-3817-1-ND; Packaging: Cut Tape (CT); Part Status: Active; Operating Temperature: -65°C ~ 150°C (TA); Mounting Type: Surface Mount; Package / Case: TO-236-3, SC-59, SOT-23-3; Supplier Device Package: SOT-23 (TO-236AB); ComponentLink1URL: http://assets.nexperia.com/documents/data-sheet/PESD1CAN.pdf; ComponentLink1Description: http://assets.nexperia.com/documents/data-sheet/PESD1CAN.pdf
R5 = RES 10K OHM 1% 1/10W 0603: as R1 on sheet Charger Interface - Connectors; Supplier 1: Digi-Key; Supplier Part Number 1: 311-10.0KHRCT-ND; Packaging: Cut Tape (CT); Part Status: Active; Composition: Thick Film; Operating Temperature: -55°C ~ 155°C; Package / Case: 0603 (1608 Metric); Supplier Device Package: 0603; Size / Dimension: 0.063" L x 0.031" W (1.60mm x 0.80mm); Height - Seated (Max): 0.022" (0.55mm); Failure Rate: -; ComponentLink1URL: http://www.yageo.com/documents/recent/PYu-RC_Group_51_RoHS_L_7.pdf; ComponentLink1Description: http://www.yageo.com/documents/recent/PYu-RC_Group_51_RoHS_L_7.pdf; Tolerance: ±1%; Power: 1/10W
R18 R19 = RES 62 OHM 0.1% 1/10W 0603: 62 Ohms ±0.1% 0.1W, 1/10W Chip Resistor 0603 (1608 Metric) Automotive AEC-Q200 Thin Film; Manufacturer: Panasonic Electronic Components; Manufacturer Part Number: ERA-3AEB620V; Temperature Coefficient: ±25ppm/°C; Supplier 1: Digi-Key; RoHS: RoHS Compliant; Category: Resistors; Stock 1: 10320; Pricing 1: 1=0.52, 10=0.447, 100=0.1748, 1000=0.07317, 2500=0.06708 (CAD); Packaging: Cut Tape (CT); Part Status: Active; Tolerance: ±0.1%; Power (Watts): 0.1W, 1/10W; Composition: Thin Film; Features: Automotive AEC-Q200; Operating Temperature: -55°C ~ 155°C; Package / Case: 0603 (1608 Metric); Supplier Device Package: 0603; Size / Dimension: 0.063" L x 0.032" W (1.60mm x 0.80mm); Height - Seated (Max): 0.022" (0.55mm); Failure Rate: -; ComponentLink1URL: https://industrial.panasonic.com/cdbs/www-data/pdf/RDM0000/AOA0000C307.pdf; ComponentLink1Description: https://industrial.panasonic.com/cdbs/www-data/pdf/RDM0000/AOA0000C307.pdf; Supplier Part Number 1: P62DBCT-ND
U1 = IC CAN SPI CONTROLLER MCP2515T-I/ST 20-TSSOP: CAN Controller CAN 2.0 SPI Interface 20-TSSOP; Manufacturer: Microchip Technology; Standards: CAN 2.0; Voltage - Supply: 2.7 V ~ 5.5 V; Current - Supply: 10mA; Supplier 1: Digi-Key; RoHS: RoHS Compliant; Category: Integrated Circuits (ICs); Stock 1: 27278; Pricing 1: 1=3.04, 25=2.5372, 100=2.3076 (CAD); Packaging: Cut Tape (CT); Part Status: Active; Protocol: CAN; Function: Controller; Interface: SPI; Operating Temperature: -40°C ~ 85°C; Package / Case: 20-TSSOP (0.173", 4.40mm Width); Supplier Device Package: 20-TSSOP; Base Part Number: MCP2515; ComponentLink1URL: http://www.microchip.com/mymicrochip/filehandler.aspx?ddocname=en011733; ComponentLink1Description: http://www.microchip.com/mymicrochip/filehandler.aspx?ddocname=en011733; Supplier Part Number 1: MCP2515T-I/STCT-ND
U2 = IC CAN Tranceiver TCAN332DR: 1/1 Transceiver CANbus SOT-23-8; Manufacturer: Texas Instruments; Supplier 1: Digi-Key; Supplier Part Number 1: 296-47355-1-ND; Stock 1: 4830; Pricing 1: 1 = 2.27000, 10 = 2.04200, 100 = 1.64100, 500 = 1.34828, 1000 = 1.11714 (USD); Min Operating Temperature: -40°C; Max Operating Temperature: 125°C; Lead Free: Lead Free
Y1 = CRYSTAL 16 MHz 18PF 2-SMD: 16MHz ±20ppm Crystal 18pF 40 Ohms 2-SMD, No Lead; Manufacturer: Abracon LLC; Manufacturer Part Number: ABM3-16.000MHZ-D2Y-T; Frequency Stability: ±30ppm; Operating Mode: Fundamental; Supplier 1: Digi-Key; RoHS: RoHS Compliant; Category: Crystals, Oscillators, Resonators; Stock 1: 27142; Pricing 1: 1=1.02, 10=0.858, 50=0.7712, 100=0.6855, 500=0.6512 (CAD); Packaging: Cut Tape (CT); Part Status: Active; Type: MHz Crystal; Frequency Tolerance: ±20ppm; Load Capacitance: 18pF; Operating Temperature: -40°C ~ 85°C; Ratings: -; Mounting Type: Surface Mount; Package / Case: 2-SMD, No Lead; Size / Dimension: 0.197" L x 0.126" W (5.00mm x 3.20mm); Height - Seated (Max): 0.051" (1.30mm); ComponentLink1URL: https://abracon.com/Resonators/abm3.pdf; ComponentLink1Description: https://abracon.com/Resonators/abm3.pdf; Supplier Part Number 1: 535-10638-1-ND